# EAGLE design scarab-trigger-shield (EAGLE 8.5.0)
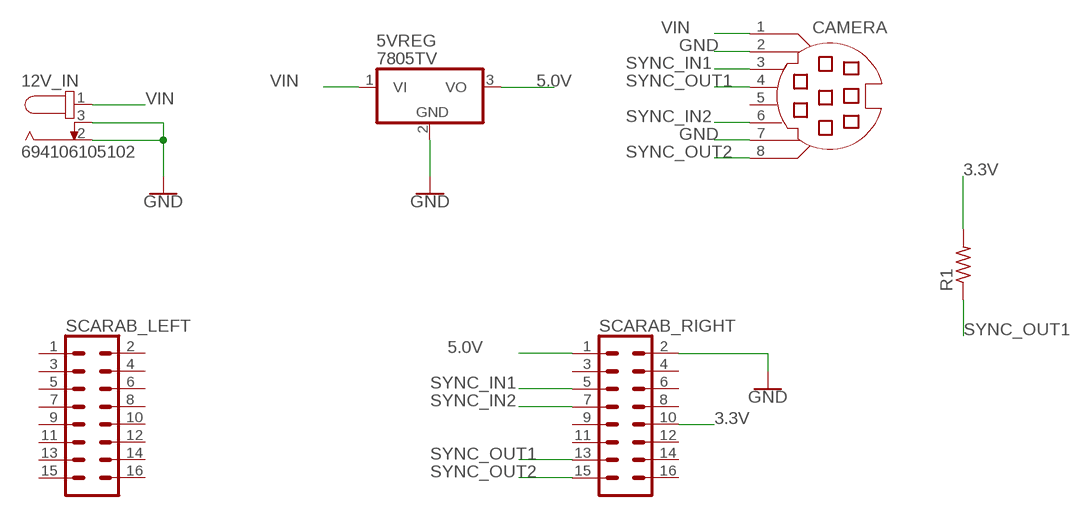
[diagram p0: schematic, sheet 1]

## Parts
5VREG  7805TV  [TO220V]
12V_IN  694106105102  [694106105102]
CAMERA  MD08SS  [MDIN08SS]
R1  R-US_M1206  [M1206]
SCARAB_LEFT  CONN_08X2  [2X8]
SCARAB_RIGHT  CONN_08X2  [2X8]

## Nets
3.3V: R1.2 SCARAB_RIGHT.10
5.0V: 5VREG.3(VO) SCARAB_RIGHT.1
GND: 5VREG.2(GND) 12V_IN.2 12V_IN.3 CAMERA.2 CAMERA.7 SCARAB_RIGHT.2
SYNC_IN1: CAMERA.3 SCARAB_RIGHT.5
SYNC_IN2: CAMERA.6 SCARAB_RIGHT.7
SYNC_OUT1: CAMERA.4 R1.1 SCARAB_RIGHT.13
SYNC_OUT2: CAMERA.8 SCARAB_RIGHT.15
VIN: 5VREG.1(VI) 12V_IN.1 CAMERA.1
Unconnected: CAMERA.5 SCARAB_LEFT.1 SCARAB_LEFT.2 SCARAB_LEFT.3 SCARAB_LEFT.4 SCARAB_LEFT.5 SCARAB_LEFT.6 SCARAB_LEFT.7 SCARAB_LEFT.8 SCARAB_LEFT.9 SCARAB_LEFT.10 SCARAB_LEFT.11 SCARAB_LEFT.12 SCARAB_LEFT.13 SCARAB_LEFT.14 SCARAB_LEFT.15 SCARAB_LEFT.16 SCARAB_RIGHT.3 SCARAB_RIGHT.4 SCARAB_RIGHT.6 SCARAB_RIGHT.8 SCARAB_RIGHT.9 SCARAB_RIGHT.11 SCARAB_RIGHT.12 SCARAB_RIGHT.14 SCARAB_RIGHT.16

## Library data of the parts
5VREG = linear:78*: Positive VOLTAGE REGULATOR Source: http://cache.national.com/ds/LM/LM78L05.pdf http://www.fairchildsemi.com/ds/LM/LM7805.pdf
12V_IN = Wurth_Elektronik_Electromechanic_DC_Power_Jack_Connectors_rev15c:694106105102: WR-DC_DC Power Jack_Right Angled_SMT Center Pin Ø2.0_Plug ID Ø2.05_Plug OD Ø5.5_with Peg ;=>Code : Con_WR-DC_SMT_694106105102_694106105102 <http://katalog.we-online.de/media/images/eican/Con_WR-DC_SMT_694106105102_pf2.jpg> Details see: http://katalog.we-online.de/em/datasheet/6941xx105102.pdf Created 2014-10-08, Karrer Zheng 2014 (C) Wurth Elektronik
CAMERA = con-yamaichi:MD08SS: YAMAICHI CONNECTOR; OC_FARNELL: unknown; OC_NEWARK: unknown
R1 = resistor:R-US_: RESISTOR, American symbol
SCARAB_LEFT SCARAB_RIGHT = SparkFun-Connectors:CONN_08X2: Multi connection point. Often used as Generic Header-pin footprint for 0.1 inch spaced/style header connections You can populate with any combo of single row headers, but if you'd like an exact match, check this: Header - 2x8 (Male, 0.1") <https://www.sparkfun.com/products/13156> (PRT-13156) On any of the 0.1 inch spaced packages, you can populate with these: Break Away Headers - Straight <https://www.sparkfun.com/products/116> (PRT-00116) Break Away Male Headers - Right Angle <https://www.sparkfun.com/products/553> (PRT-00553) Female Headers <https://www.sparkfun.com/products/115> (PRT-00115) Break Away Headers - Machine Pin <https://www.sparkfun.com/products/117> (PRT-00117) Break Away Female Headers - Swiss Machine Pin <https://www.sparkfun.com/products/743> (PRT-00743)

## Board
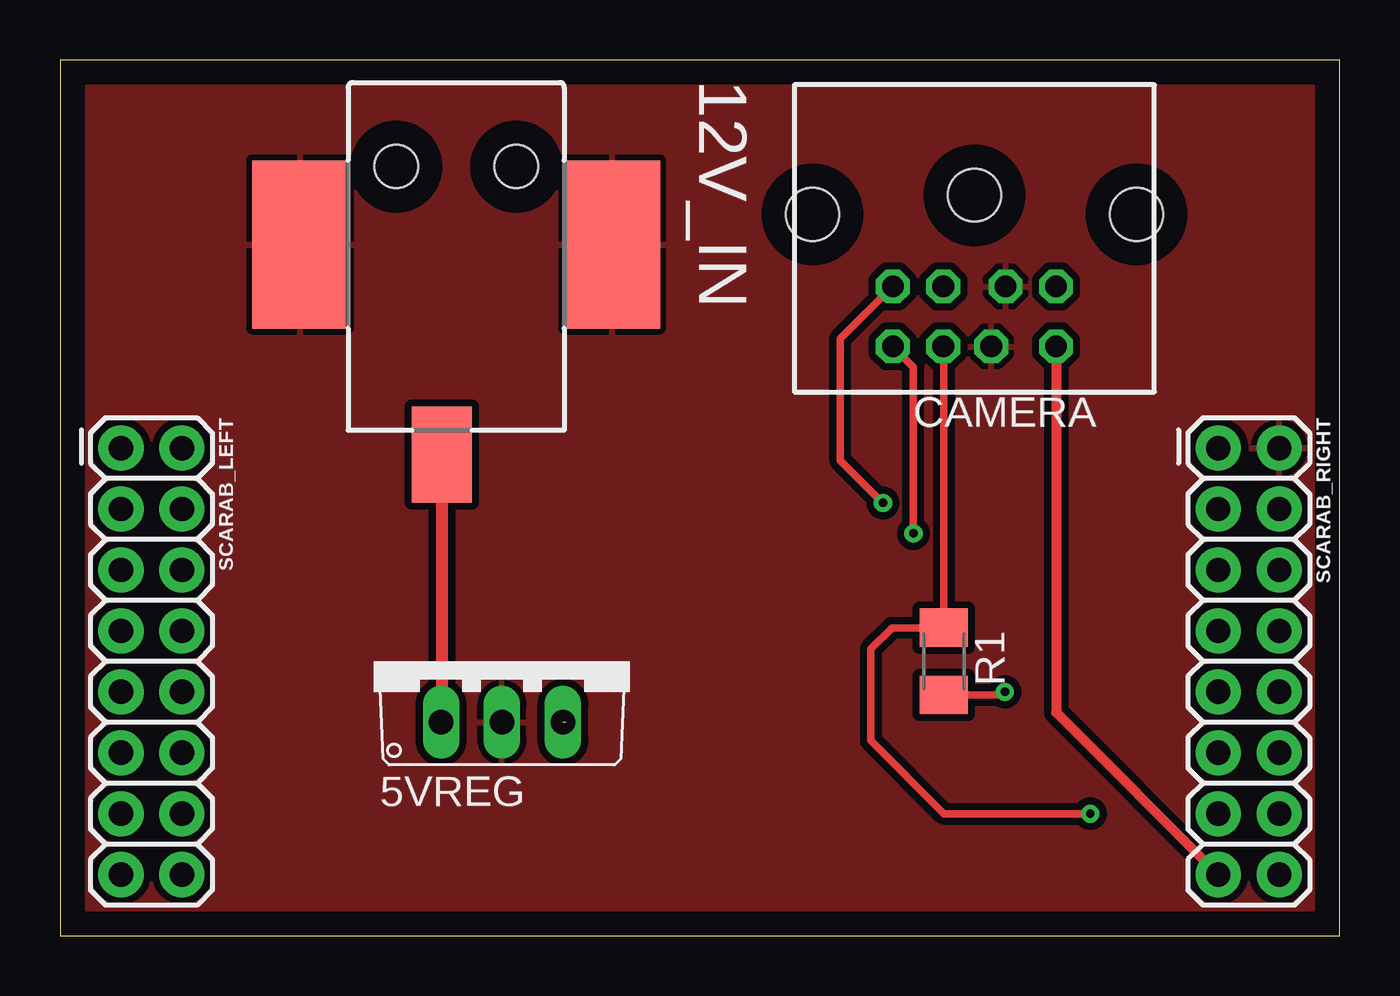
[diagram p1: board, top side]
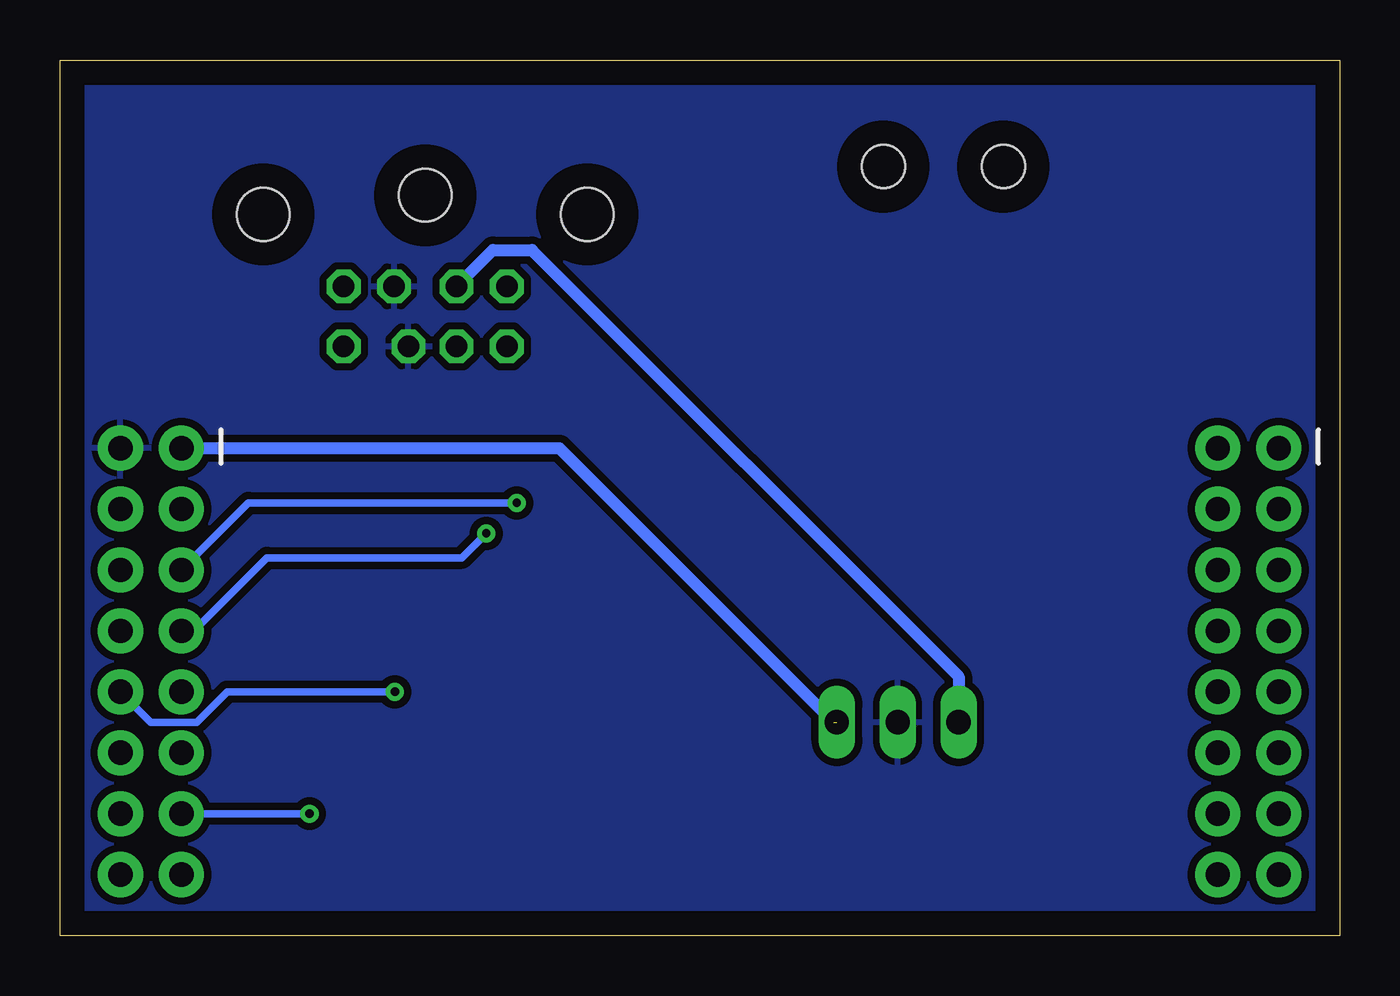
[diagram p2: board, bottom side, seen from below]

Size 53.32 x 36.5 mm. Coordinates in mm from the lower left corner, seen from the top.
Outline: 0,0 53.32,0 53.32,36.5 0,36.5 0,0
Copper layers (1*16): Top 0.035mm / dielectric 1.5mm / Bottom 0.035mm
Design rules "default": minimum track width 6mil, minimum drill 0.35mm, track to track 6mil, track to pad 6mil, pad to pad 6mil, via to via 6mil, smd to smd 6mil, copper to edge 40mil, drill to drill 6mil, minimum pad ring 10mil, minimum via ring 8mil, stop-mask expansion 4mil, vias tented up to drill 0mil, thermal gap 10mil

### Footprints (pad centres in the part's own frame; a part is rotated, then mirrored left to right if it is on the bottom)
TO220V = drill 1.016 long: 1 -2.54,-2.54; 2 0,-2.54; 3 2.54,-2.54
694106105102 = smd 4 x 2.5: 1 15.5,-0.6 | smd 7 x 4: 2 6.75,6.5; 3 6.75,-6.5 | hole 1.8: 3.5,2.5; 3.5,-2.5
MDIN08SS = drill 0.9 octagon: 1 1.3,8.5; 2 -1.3,8.5; 3 3.4,8.5; 4 1.3,11; 5 -3.4,8.5; 6 3.4,11; 7 -0.7,11; 8 -3.4,11 | hole 2.2: -6.75,5.5; 0,4.7; 6.75,5.5
M1206 = smd 1.6 x 2: 1 -1.4,0; 2 1.4,0
2X8 = drill 1.016 pad 1.88: 1 0,0; 2 0,2.54; 3 2.54,0; 4 2.54,2.54; 5 5.08,0; 6 5.08,2.54; 7 7.62,0; 8 7.62,2.54; 9 10.16,0; 10 10.16,2.54; 11 12.7,0; 12 12.7,2.54; 13 15.24,0; 14 15.24,2.54; 15 17.78,0; 16 17.78,2.54

### Placement (x,y rotation side)
5VREG  18.41,11.43 0 top
12V_IN  16.51,35.56 270 top
CAMERA  38.1,35.56 180 top
R1  36.83,11.43 270 top
SCARAB_LEFT  2.54,20.32 270 top
SCARAB_RIGHT  48.26,20.32 270 top

### Tracks (layer width: path | path; a pad name or v marks a point on that pad's centre or on a via)
3.3V  (via drill 0.35)
  Top 0.305: R1.2 39.24,10.03 v39.37,10.16
  Bottom 0.305: v39.37,10.16 46.35,10.16 47.62,8.89 49.53,8.89 SCARAB_RIGHT.10
5.0V  (1 unrouted)
  Bottom 0.508: SCARAB_RIGHT.1 32.51,20.32 21.08,8.89
GND
  pour Top (isolate 0.305): 0,35.56 53.34,35.56 53.34,0 0,0
  pour Bottom (isolate 0.305): 0,35.56 53.34,35.56 53.34,0 0,0
SYNC_IN1  (via drill 0.35)
  Top 0.305: v34.29,18.03 32.51,19.81 32.51,24.89 34.68,27.06 CAMERA.3
  Bottom 0.305: SCARAB_RIGHT.5 45.47,18.03 v34.29,18.03
SYNC_IN2  (via drill 0.35)
  Top 0.305: v35.56,16.76 35.56,23.7 CAMERA.6
  Bottom 0.305: SCARAB_RIGHT.7 47.75,12.7 44.7,15.75 36.58,15.75 v35.56,16.76
SYNC_OUT1  (via drill 0.35)
  Top 0.305: CAMERA.4 36.83,24.53 R1.1 34.67,12.83 33.78,11.94 33.78,8.13 36.83,5.08 v42.93,5.08
  Bottom 0.305: v42.93,5.08 SCARAB_RIGHT.13
SYNC_OUT2
  Top 0.406: CAMERA.8 41.5,9.3 SCARAB_RIGHT.15
VIN
  Top 0.508: 12V_IN.1 15.91,8.93 5VREG.1
  Bottom 0.508: CAMERA.1 35.28,28.57 33.66,28.57 15.88,10.79 5VREG.1